# EAGLE design rapidshark-display-butt-mk-1.0 (EAGLE 6.5.0)
AUTHOR: sean@yak.net
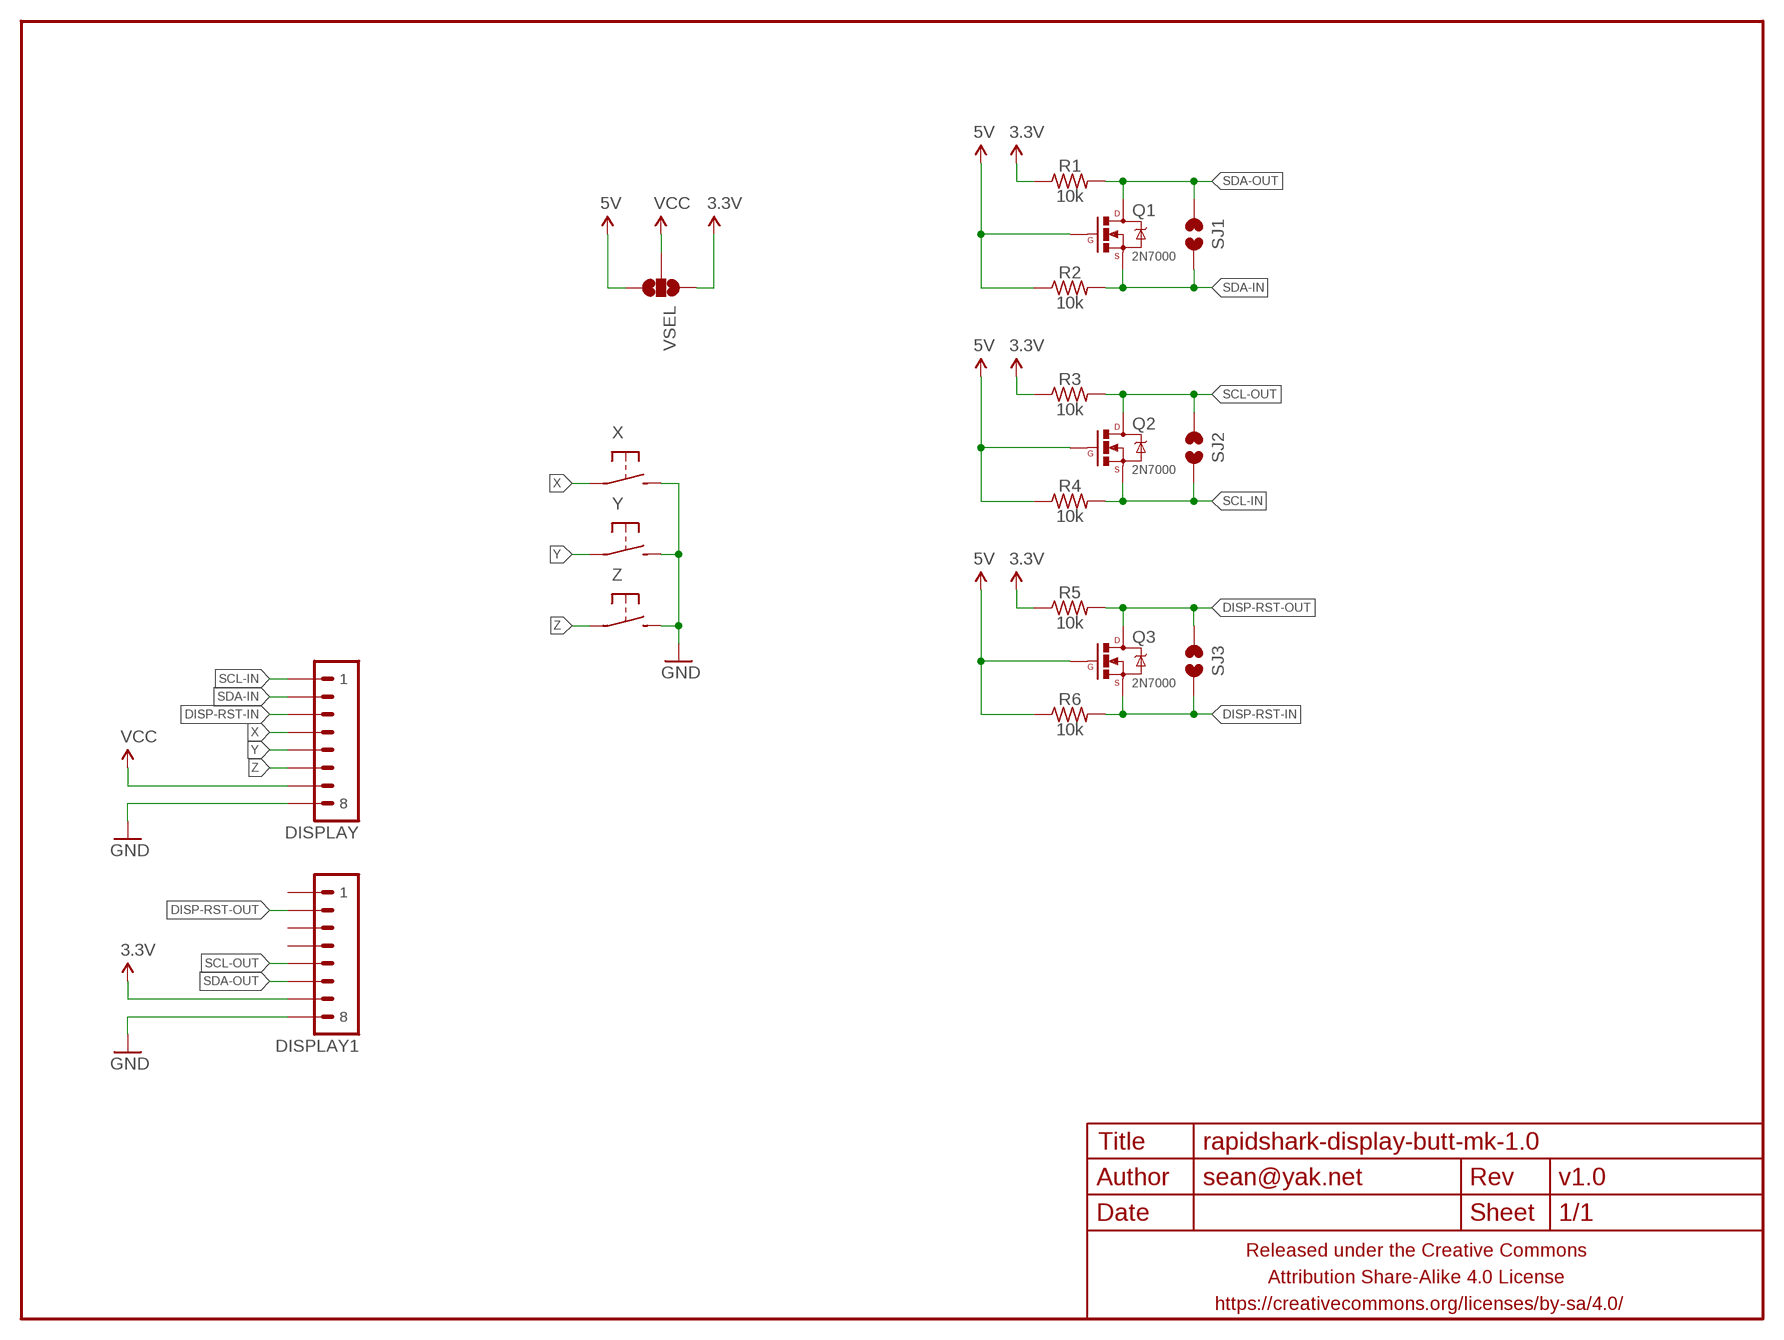
[diagram p0: schematic, sheet 1]

## Parts
DISPLAY  M08JST-PH-VERT-PTH  [JST-8-VERT-PTH]
DISPLAY1  M081X08  [1X08]
FRAME1  FRAME-LETTERNO_PACKAGE  [DUMMY]
Q1  2N7000  MOSFET-NCHANNEL2N7000-AMMO  [TO-92-AMMO]
Q2  2N7000  MOSFET-NCHANNEL2N7000-AMMO  [TO-92-AMMO]
Q3  2N7000  MOSFET-NCHANNEL2N7000-AMMO  [TO-92-AMMO]
R1  10k  RESISTORPTH-AXIAL-5.08MM  [RESISTOR-AXIAL-PTH-5.08MM]
R2  10k  RESISTORPTH-AXIAL-5.08MM  [RESISTOR-AXIAL-PTH-5.08MM]
R3  10k  RESISTORPTH-AXIAL-5.08MM  [RESISTOR-AXIAL-PTH-5.08MM]
R4  10k  RESISTORPTH-AXIAL-5.08MM  [RESISTOR-AXIAL-PTH-5.08MM]
R5  10k  RESISTORPTH-AXIAL-5.08MM  [RESISTOR-AXIAL-PTH-5.08MM]
R6  10k  RESISTORPTH-AXIAL-5.08MM  [RESISTOR-AXIAL-PTH-5.08MM]
SJ1  JUMPER-PAD-2-NOYES_SILK  [PAD-JUMPER-2-NO_YES_SILK]
SJ2  JUMPER-PAD-2-NOYES_SILK  [PAD-JUMPER-2-NO_YES_SILK]
SJ3  JUMPER-PAD-2-NOYES_SILK  [PAD-JUMPER-2-NO_YES_SILK]
VSEL  JUMPER-PAD-3-NOFULL_BOX_SILK  [PAD-JUMPER-3-NO_YES_SILK_FULL_BOX]
X  SPST-NO-TACT6MM-PTH-SMALL-PADS  [DTS-6-SMALL-PADS]
Y  SPST-NO-TACT6MM-PTH-SMALL-PADS  [DTS-6-SMALL-PADS]
Z  SPST-NO-TACT6MM-PTH-SMALL-PADS  [DTS-6-SMALL-PADS]

## Nets
3.3V: DISPLAY1.7 R1.P$1 R3.P$1 R5.P$1 VSEL.1
5V: Q1.2(G) Q2.2(G) Q3.2(G) R2.P$1 R4.P$1 R6.P$1 VSEL.3
DISP-RST-IN: DISPLAY.3 Q3.1(S) R6.P$2 SJ3.1
DISP-RST-OUT: DISPLAY1.2 Q3.3(D) R5.P$2 SJ3.2
GND: DISPLAY1.8 DISPLAY.8 X.3 X.4 Y.3 Y.4 Z.3 Z.4
SCL-IN: DISPLAY.1 Q2.1(S) R4.P$2 SJ2.1
SCL-OUT: DISPLAY1.5 Q2.3(D) R3.P$2 SJ2.2
SDA-IN: DISPLAY.2 Q1.1(S) R2.P$2 SJ1.1
SDA-OUT: DISPLAY1.6 Q1.3(D) R1.P$2 SJ1.2
VCC: DISPLAY.7 VSEL.2
X: DISPLAY.4 X.1 X.2
Y: DISPLAY.5 Y.1 Y.2
Z: DISPLAY.6 Z.1 Z.2
Unconnected: DISPLAY1.1 DISPLAY1.3 DISPLAY1.4

## Library data of the parts
DISPLAY DISPLAY1 = A_butts:M08: Header 8 Standard 8-pin 0.1" header. Use with straight break away headers (SKU : PRT-00116), right angle break away headers (PRT-00553), swiss pins (PRT-00743), machine pins (PRT-00117), and female headers (PRT-00115).
FRAME1 = A_butts:FRAME-LETTER: Schematic Frame Standard 8.5x11 US Letter frame; DESIGNER: sean@yak.net; VERSION: v1.0
Q1-Q3 = A_butts:MOSFET-NCHANNEL: Common NMOSFET Parts MFG P/N Store ID Prod ID FDD8780 TRANS-09984 SI7820DN TRANS-11055 FDS6630A IC-08089 2N7002PW TRANS-11151 FQP30N06L COM-10213 TRANS-10060 BSS123LT1G TRANS-08345 BSS138 TRANS-00830 BS170 2N7000
R1-R6 = A_butts:RESISTOR: RESISTOR, American symbol
SJ1-SJ3 = A_butts:JUMPER-PAD-2-NO
VSEL = A_butts:JUMPER-PAD-3-NO
X Y Z = A_butts:SPST-NO-TACT

## Board
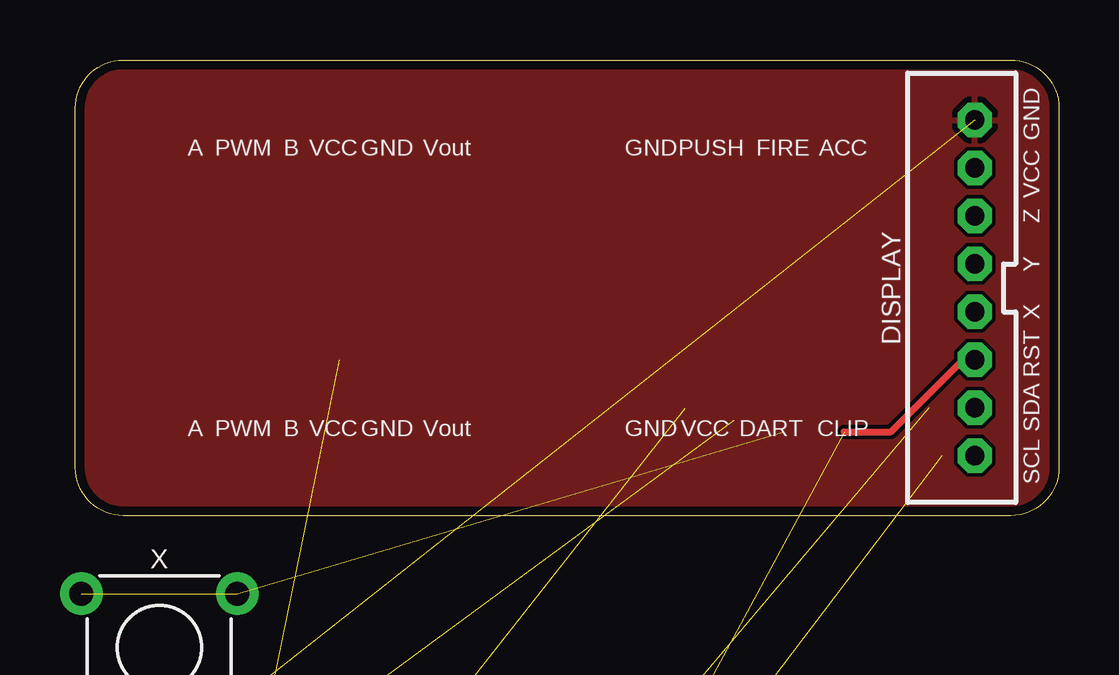
[diagram p1: board, top side]
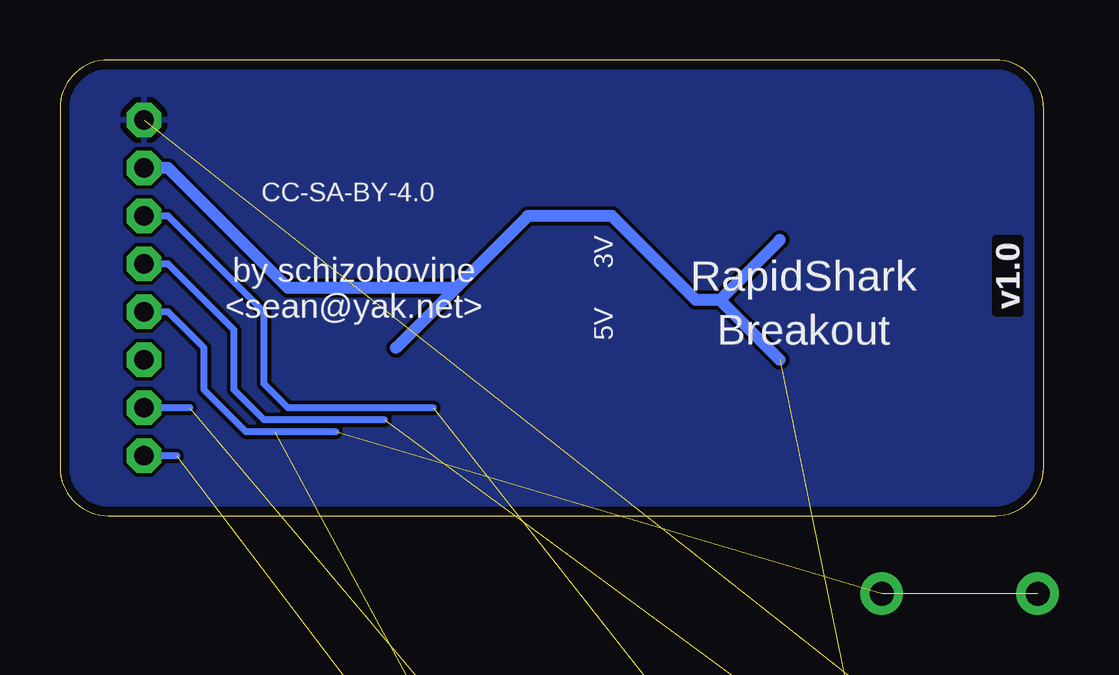
[diagram p2: board, bottom side, seen from below]

Size 41 x 19 mm. Coordinates in mm from the lower left corner, seen from the top.
Outline: 0,2 0,17 arc-90 2,19 39,19 arc-90 41,17 41,2 arc-90 39,0 2,0 arc-90 0,2
Copper layers (1*16): Top 0.0356mm / dielectric 1.5011mm / Bottom 0.0356mm
Design rules "LaenPCBOrder_2": minimum track width 6mil, minimum drill 13mil, track to track 6mil, track to pad 6mil, pad to pad 6mil, via to via 6mil, smd to smd 6mil, copper to edge 15mil, drill to drill 6mil, minimum pad ring 7mil, minimum via ring 7mil, stop-mask expansion 3mil, vias tented up to drill 20mil, thermal gap 10mil

### Footprints (pad centres in the part's own frame; a part is rotated, then mirrored left to right if it is on the bottom)
JST-8-VERT-PTH = drill 0.8 pad 1.422 octagon: 1 -7,0; 2 -5,0; 3 -3,0; 4 -1,0; 5 1,0; 6 3,0; 7 5,0; 8 7,0
1X08 = drill 1 pad 1.778 octagon: 1 0,0; 2 2.54,0; 3 5.08,0; 4 7.62,0; 5 10.16,0; 6 12.7,0; 7 15.24,0; 8 17.78,0
TO-92-AMMO = drill 0.9 pad 1.5 octagon: 1 -2.54,0; 2 0,0; 3 2.54,0
RESISTOR-AXIAL-PTH-5.08MM = drill 0.9 pad 1.5 octagon: P$1 -2.54,0; P$2 2.54,0
PAD-JUMPER-2-NO_YES_SILK = smd 0.635 x 1.27: 1 -0.45,0; 2 0.45,0
PAD-JUMPER-3-NO_YES_SILK_FULL_BOX = smd 1.2 x 1.6: 1 -1.524,0; 2 0,0; 3 1.524,0
DTS-6-SMALL-PADS = drill 1 pad 1.778: 1 -3.25,2.25; 2 3.25,2.25; 3 -3.25,-2.25; 4 3.25,-2.25

### Placement (x,y rotation side)
DISPLAY  37.5,9.5 90 top
DISPLAY1  0.5,-65.5 0 top  (outside the outline)
FRAME1  0,0 270 bottom
Q1  3,-35 0 top  (outside the outline)
Q2  3,-44.5 0 top  (outside the outline)
Q3  3,-55 0 top  (outside the outline)
R1  3.5,-27 0 top  (outside the outline)
R2  3.5,-30.5 0 top  (outside the outline)
R3  3.5,-48 0 top  (outside the outline)
R4  3.5,-50.5 0 top  (outside the outline)
R5  3.5,-58.5 0 top  (outside the outline)
R6  3.5,-61 0 top  (outside the outline)
SJ1  -2.5,-61 0 top  (outside the outline)
SJ2  -5,-61 0 top  (outside the outline)
SJ3  -7.5,-61 0 top  (outside the outline)
VSEL  1.5,-40 0 top  (outside the outline)
X  3.5,-5.5 0 top  (outside the outline)
Y  3.5,-13.5 0 top  (outside the outline)
Z  3.5,-21.5 0 top  (outside the outline)

### Tracks (layer width: path | path; a pad name or v marks a point on that pad's centre or on a via)
3.3V  (4 unrouted)
5V  (6 unrouted)
DISP-RST-IN  (3 unrouted)
  Top 0.3: 32.05,3.5 34,3.5 37,6.5 DISPLAY.3
DISP-RST-OUT  (3 unrouted)
GND  (7 unrouted)
  pour Top (rank 6): 41,0 0,0 0,19 41,19
  pour Bottom (rank 6): 41,0 0,0 0,19 41,19
SCL-IN  (3 unrouted)
  Bottom 0.3: 36.13,2.5 DISPLAY.1
SCL-OUT  (3 unrouted)
SDA-IN  (3 unrouted)
  Bottom 0.3: 35.59,4.5 DISPLAY.2
SDA-OUT  (3 unrouted)
VCC  (1 unrouted)
  Bottom 0.5: 24.5,9.5 31.5,9.5 36.5,14.5 DISPLAY.7 | 27,7 24.5,9.5 | 11,11.5 13.5,9 | 11,6.5 13.5,9 | 13.5,9 14.5,9 18,12.5 21.5,12.5 24.5,9.5
X  (2 unrouted)
  Bottom 0.3: 29.51,3.5 33.25,3.5 35,5.25 35,7 36.5,8.5 DISPLAY.4
Y  (2 unrouted)
  Bottom 0.3: 27.47,4 32.5,4 33.75,5.25 33.75,7.75 36.5,10.5 DISPLAY.5
Z  (2 unrouted)
  Bottom 0.3: 25.43,4.5 31.5,4.5 32.5,5.5 32.5,8.5 36.5,12.5 DISPLAY.6

### Text on the board
tPlace: GND | A | PWM | B | VCC | GND | Vout | GND | PUSH | FIRE | ACC | VCC | Z | Y | X | RST | A | PWM | B | VCC | GND | Vout | GND | VCC | DART | CLIP | SDA | SCL
bPlace: CC-SA-BY-4.0 | 3V | RapidShark | by schizobovine / <sean@yak.net> | Breakout | 5V